# EAGLE design bm20 breakout (EAGLE 9.6.2)
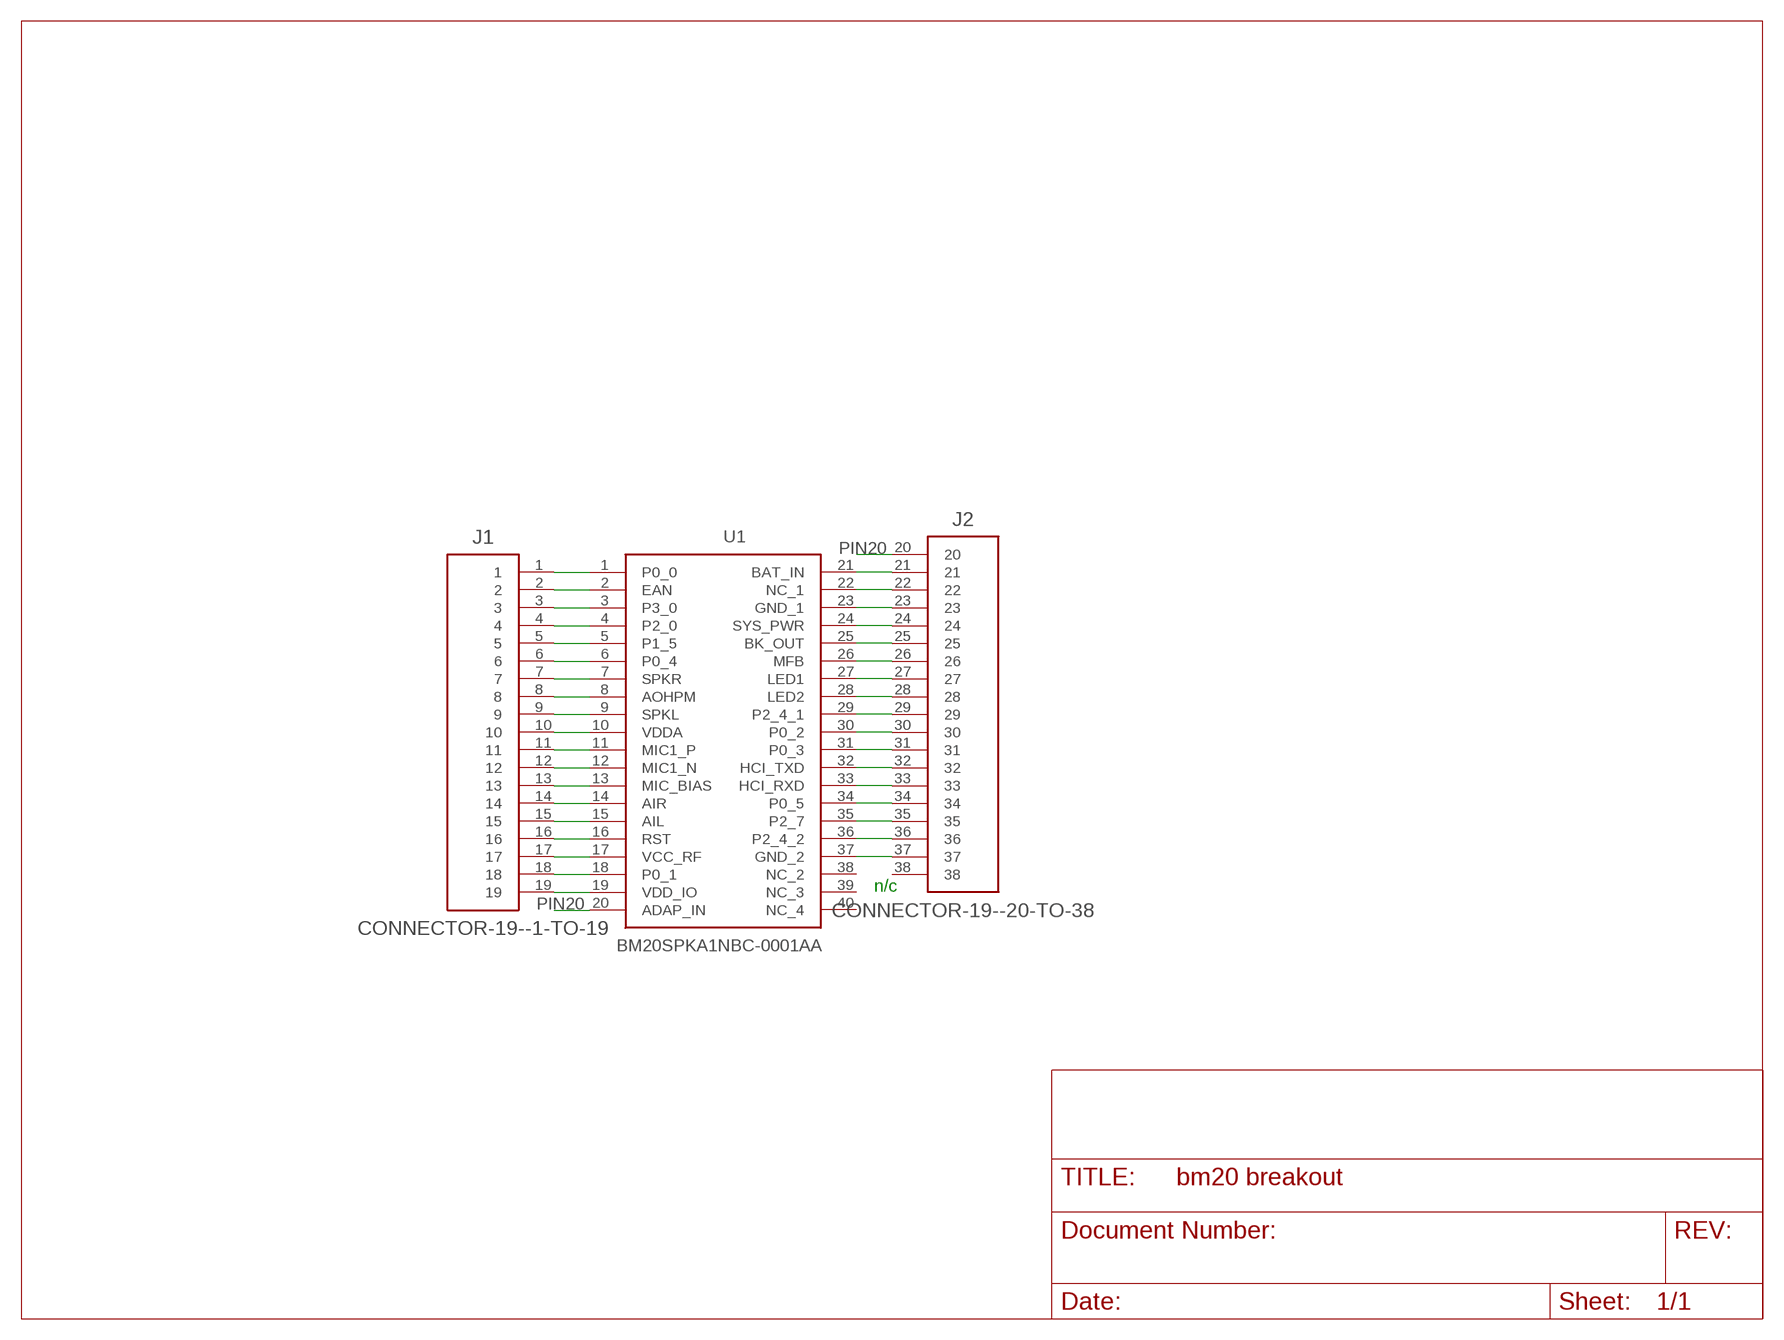
[diagram p0: schematic, sheet 1]

## Parts
J1  CONNECTOR-19--1-TO-19  [ESQ-119-XX-XX-S]
J2  CONNECTOR-19--20-TO-38  [ESQ-119-XX-XX-S--PIN-1-ROUND]
U1  BM20SPKA1NBC-0001AA  [BM20SPKA1NBC0001AA]

## Nets
N$1: J1.4 U1.4(P2_0)
N$2: J1.1 U1.1(P0_0)
N$3: J1.5 U1.5(P1_5)
N$4: J1.2 U1.2(EAN)
N$5: J1.6 U1.6(P0_4)
N$6: J1.3 U1.3(P3_0)
N$7: J1.7 U1.7(SPKR)
N$8: J1.8 U1.8(AOHPM)
N$9: J1.9 U1.9(SPKL)
N$10: J1.10 U1.10(VDDA)
N$11: J1.11 U1.11(MIC1_P)
N$12: J1.12 U1.12(MIC1_N)
N$13: J1.13 U1.13(MIC_BIAS)
N$14: J1.14 U1.14(AIR)
N$15: J1.15 U1.15(AIL)
N$16: J1.16 U1.16(RST)
N$17: J1.17 U1.17(VCC_RF)
N$18: J1.18 U1.18(P0_1)
N$19: J1.19 U1.19(VDD_IO)
N$20: J2.23 U1.23(GND_1)
N$21: J2.24 U1.24(SYS_PWR)
N$22: J2.21 U1.21(BAT_IN)
N$23: J2.25 U1.25(BK_OUT)
N$24: J2.22 U1.22(NC_1)
N$25: J2.26 U1.26(MFB)
N$26: J2.27 U1.27(LED1)
N$27: J2.28 U1.28(LED2)
N$28: J2.29 U1.29(P2_4_1)
N$29: J2.30 U1.30(P0_2)
N$30: J2.31 U1.31(P0_3)
N$31: J2.32 U1.32(HCI_TXD)
N$32: J2.33 U1.33(HCI_RXD)
N$33: J2.34 U1.34(P0_5)
N$34: J2.35 U1.35(P2_7)
N$35: J2.36 U1.36(P2_4_2)
N$36: J2.37 U1.37(GND_2)
PIN20: J2.20 U1.20(ADAP_IN)
Unconnected: J2.38 U1.38(NC_2) U1.39(NC_3) U1.40(NC_4)

## Notes on the sheet
- n/c

## Library data of the parts
J1 = eagle-library-engr-245-s22:CONNECTOR-19--1-TO-19
J2 = eagle-library-engr-245-s22:CONNECTOR-19--20-TO-38
U1 = eagle-library-engr-245-s22:BM20SPKA1NBC-0001AA: Bluetooth Modules (802.15.1) BT 4.1 Stereo Audio No-Shield/Antenna Source: Datasheet <https://componentsearchengine.com/Datasheets/1/BM20SPKA1NBC-0001AA.pdf>; DESCRIPTION: Bluetooth Modules (802.15.1) BT 4.1 Stereo Audio No-Shield/Antenna; HEIGHT: 2.5mm; MANUFACTURER_NAME: Microchip; MANUFACTURER_PART_NUMBER: BM20SPKA1NBC-0001AA; MOUSER_PART_NUMBER: 579-SPKA1NBC-0001AA; MOUSER_PRICE-STOCK: https://www.mouser.co.uk/ProductDetail/Microchip-Technology/BM20SPKA1NBC-0001AA?qs=uus7iwvxYD8HqvnWsd76VQ%3D%3D

## Board
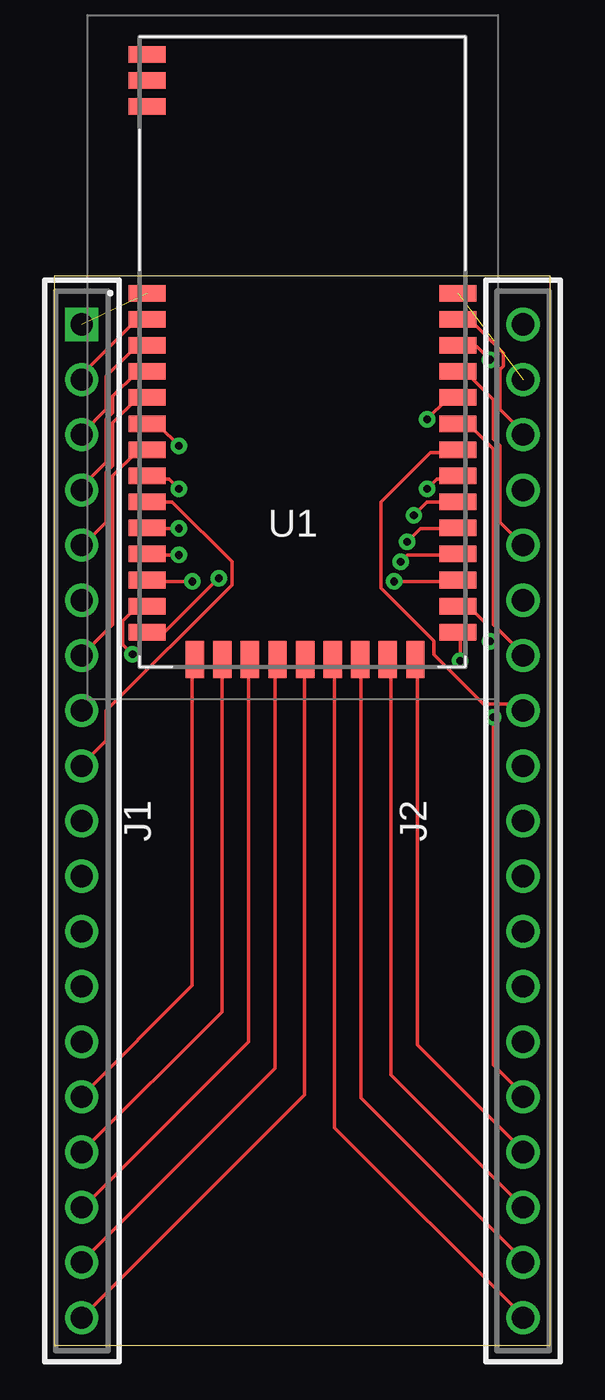
[diagram p1: board, top side]
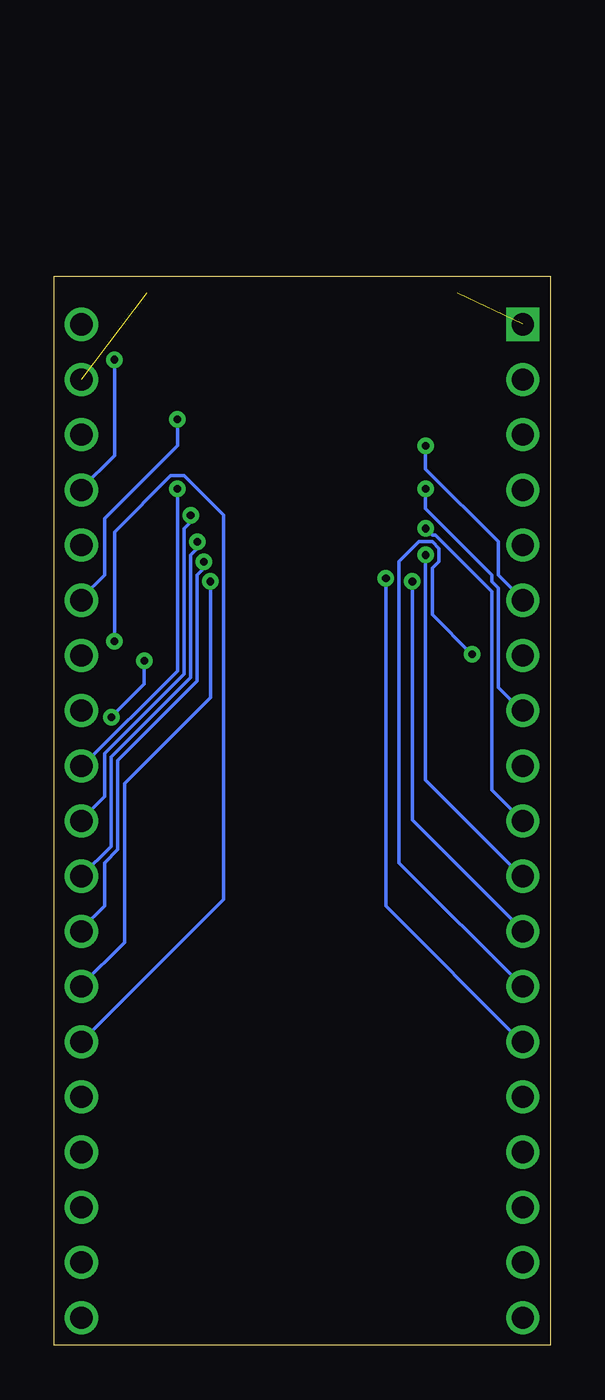
[diagram p2: board, bottom side, seen from below]

Size 22.84 x 49.2 mm. Coordinates in mm from the lower left corner, seen from the top.
Outline: 0,0 22.84,0 22.84,49.2 0,49.2 0,0
Copper layers (1*16): Top 0.035mm / dielectric 1.5mm / Bottom 0.035mm
Design rules "default": minimum track width 6mil, minimum drill 0.35mm, track to track 6mil, track to pad 6mil, pad to pad 6mil, via to via 6mil, smd to smd 6mil, copper to edge 40mil, drill to drill 6mil, minimum pad ring 10mil, minimum via ring 8mil, stop-mask expansion 4mil, vias tented up to drill 0mil, thermal gap 10mil

### Footprints (pad centres in the part's own frame; a part is rotated, then mirrored left to right if it is on the bottom)
ESQ-119-XX-XX-S = drill 1.016 pad 1.524 square: 1 0,0 | drill 1.016 pad 1.524: 2 2.54,0; 3 5.08,0; 4 7.62,0; 5 10.16,0; 6 12.7,0; 7 15.24,0; 8 17.78,0; 9 20.32,0; 10 22.86,0; 11 25.4,0; 12 27.94,0; 13 30.48,0; 14 33.02,0; 15 35.56,0; 16 38.1,0; 17 40.64,0; 18 43.18,0; 19 45.72,0
ESQ-119-XX-XX-S--PIN-1-ROUND = drill 1.016 pad 1.524: 20 -22.86,0; 21 -20.32,0; 22 -17.78,0; 23 -15.24,0; 24 -12.7,0; 25 -10.16,0; 26 -7.62,0; 27 -5.08,0; 28 -2.54,0; 29 0,0; 30 2.54,0; 31 5.08,0; 32 7.62,0; 33 10.16,0; 34 12.7,0; 35 15.24,0; 36 17.78,0; 37 20.32,0; 38 22.86,0
BM20SPKA1NBC0001AA = smd 1.7 x 0.76: 1 -7.15,2.7; 2 -7.15,1.5; 3 -7.15,0.3; 4 -7.15,-0.9; 5 -7.15,-2.1; 6 -7.15,-3.3; 7 -7.15,-4.5; 8 -7.15,-5.7; 9 -7.15,-6.9; 10 -7.15,-8.1; 11 -7.15,-9.3; 12 -7.15,-10.5; 13 -7.15,-11.7; 14 -7.15,-12.9; 24 7.15,-12.9; 25 7.15,-11.7; 26 7.15,-10.5; 27 7.15,-9.3; 28 7.15,-8.1; 29 7.15,-6.9; 30 7.15,-5.7; 31 7.15,-4.5; 32 7.15,-3.3; 33 7.15,-2.1; 34 7.15,-0.9; 35 7.15,0.3; 36 7.15,1.5; 37 7.15,2.7; 38 -7.15,13.7; 39 -7.15,12.5; 40 -7.15,11.3 | smd 0.85 x 1.7: 15 -4.96,-14.15; 16 -3.69,-14.15; 17 -2.42,-14.15; 18 -1.15,-14.15; 19 0.12,-14.15; 20 1.39,-14.15; 21 2.66,-14.15; 22 3.93,-14.15; 23 5.2,-14.15

### Placement (x,y rotation side)
J1  1.27,46.99 270 top
J2  21.59,24.13 90 top
U1  11.43,45.72 0 top

### Tracks (layer width: path | path; a pad name or v marks a point on that pad's centre or on a via)
N$1
  Top 0.152: U1.4 4.22,44.75 3.76,44.75 2.69,43.69 2.69,42.93 2.39,42.62 2.39,40.64 1.17,39.42 J1.4
N$2  (1 unrouted)
N$3
  Top 0.152: U1.5 4.22,43.54 3.76,43.54 2.69,42.47 2.69,40.49 2.39,40.18 2.39,37.9 1.32,36.83 J1.5
N$4
  Top 0.152: U1.2 4.22,47.19 3.76,47.19 1.32,44.75 1.32,44.45 J1.2
N$5  (via drill 0.35)
  Top 0.152: v5.74,41.4 4.83,42.32 4.37,42.32 U1.6
  Bottom 0.152: v5.74,41.4 5.74,40.33 2.39,36.98 2.39,35.46 1.32,34.39 J1.6
N$6
  Top 0.152: U1.3 4.22,45.97 3.76,45.97 2.39,44.6 2.39,43.08 1.32,42.01 J1.3
N$7
  Top 0.152: J1.7 2.69,33.17 2.69,40.03 3.76,41.1 4.22,41.1 U1.7
N$8  (via drill 0.35)
  Top 0.152: v5.74,39.42 5.28,39.88 4.37,39.88 U1.8
  Bottom 0.152: v5.74,39.42 5.74,38.51 2.69,35.46 2.69,35.15 2.39,34.85 2.39,30.28 1.32,29.21 J1.8
N$9
  Top 0.152: U1.9 4.37,38.81 5.44,38.81 8.18,36.07 8.18,35 2.39,29.21 2.39,27.84 1.32,26.77 J1.9
N$10  (via drill 0.35)
  Top 0.152: v5.74,37.59 4.37,37.59 U1.10
  Bottom 0.152: v5.74,37.59 5.44,37.29 5.28,37.29 2.69,34.7 2.69,25.55 J1.10
N$11  (via drill 0.35)
  Top 0.152: v5.74,36.37 4.37,36.37 U1.11
  Bottom 0.152: v5.74,36.37 5.74,26.01 1.32,21.59 J1.11
N$12  (via drill 0.35)
  Top 0.152: v6.35,35.15 4.37,35.15 U1.12
  Bottom 0.152: v6.35,35.15 6.35,24.18 1.32,19.15 J1.12
N$13  (via drill 0.35)
  Top 0.152: v3.61,31.8 3.15,32.26 3.15,33.32 3.76,33.93 4.22,33.93 U1.13
  Bottom 0.152: v3.61,31.8 5.44,33.63 5.44,35.76 5.13,36.07 5.13,36.68 5.44,36.98 6.04,36.98 6.96,36.07 6.96,22.2 J1.13
N$14  (via drill 0.35)
  Top 0.152: v7.57,35.31 5.13,32.87 4.37,32.87 U1.14
  Bottom 0.152: v7.57,35.31 7.57,20.22 1.32,13.97 J1.14
N$15
  Top 0.152: U1.15 6.35,31.5 6.35,16.56 1.32,11.53 J1.15
N$16
  Top 0.152: J1.16 7.72,15.34 7.72,31.5 U1.16
N$17
  Top 0.152: U1.17 8.94,31.5 8.94,13.97 1.32,6.35 J1.17
N$18
  Top 0.152: U1.18 10.16,31.5 10.16,12.75 1.32,3.91 J1.18
N$19
  Top 0.152: J1.19 11.53,11.53 11.53,31.5 U1.19
N$20
  Top 0.152: U1.23 16.71,31.5 16.71,13.82 21.59,8.94 J2.23
N$21  (via drill 0.35)
  Top 0.152: v18.69,31.5 18.69,32.71 U1.24 | v20.22,28.91 20.22,12.9 21.59,11.53 J2.24
  Bottom 0.152: v18.69,31.5 18.69,30.43 v20.22,28.91
N$22
  Top 0.152: U1.21 14.12,31.5 14.12,11.38 21.59,3.91 J2.21
N$23  (via drill 0.35)
  Top 0.152: v20.07,32.41 19.91,32.56 19.91,33.17 19.15,33.93 18.69,33.93 U1.25
  Bottom 0.152: v20.07,32.41 20.07,37.44 17.48,40.03 16.87,40.03 15.04,38.2 15.04,20.52 J2.25
N$24
  Top 0.152: J2.22 15.49,12.45 15.49,31.5 U1.22
N$25  (via drill 0.35)
  Top 0.152: v15.65,35.15 18.54,35.15 U1.26
  Bottom 0.152: v15.65,35.15 15.65,29.82 19.61,25.86 19.61,18.54 21.59,16.56 J2.26
N$26  (via drill 0.35)
  Top 0.152: v15.95,36.07 16.26,36.37 18.54,36.37 U1.27
  Bottom 0.152: v15.95,36.07 15.95,35.76 16.26,35.46 16.26,30.58 19.91,26.92 19.91,22.81 20.52,22.2 20.52,20.22 21.59,19.15 J2.27
N$27  (via drill 0.35)
  Top 0.152: v16.26,36.98 16.87,37.59 18.54,37.59 U1.28
  Bottom 0.152: v16.26,36.98 16.26,36.68 16.56,36.37 16.56,30.73 20.22,27.08 20.22,22.96 J2.28
N$28  (via drill 0.35)
  Top 0.152: v16.56,38.2 17.17,38.81 18.54,38.81 U1.29
  Bottom 0.152: v16.56,38.2 16.56,37.9 16.87,37.59 16.87,30.89 20.52,27.23 20.52,25.25 21.59,24.18 J2.29
N$29  (via drill 0.35)
  Top 0.152: v17.17,39.42 17.63,39.88 18.54,39.88 U1.30
  Bottom 0.152: v17.17,39.42 17.17,31.04 21.59,26.62 J2.30
N$30
  Top 0.152: J2.31 21.29,29.52 19.76,29.52 17.48,31.8 17.48,32.41 15.04,34.85 15.04,38.81 17.32,41.1 18.54,41.1 U1.31
N$31
  Top 0.152: U1.32 18.69,42.32 19.15,42.32 20.22,41.25 20.22,33.17 21.59,31.8 J2.32
N$32  (via drill 0.35)
  Top 0.152: v17.17,42.62 18.09,43.54 18.54,43.54 U1.33
  Bottom 0.152: v17.17,42.62 17.17,41.4 20.52,38.05 20.52,35.46 21.59,34.39 J2.33
N$33
  Top 0.152: J2.34 20.52,37.9 20.52,41.4 20.22,41.71 20.22,43.54 19,44.75 18.69,44.75 U1.34
N$34  (via drill 0.35)
  Top 0.152: v20.07,45.36 19.46,45.97 18.69,45.97 U1.35
  Bottom 0.152: v20.07,45.36 20.07,40.95 21.59,39.42 J2.35
N$35
  Top 0.152: U1.36 18.69,47.19 19.15,47.19 20.68,45.67 20.68,45.06 20.52,44.91 20.52,43.08 21.59,42.01 J2.36
N$36  (1 unrouted)
PIN20
  Top 0.152: U1.20 12.9,31.5 12.9,10.01 21.59,1.32 J2.20